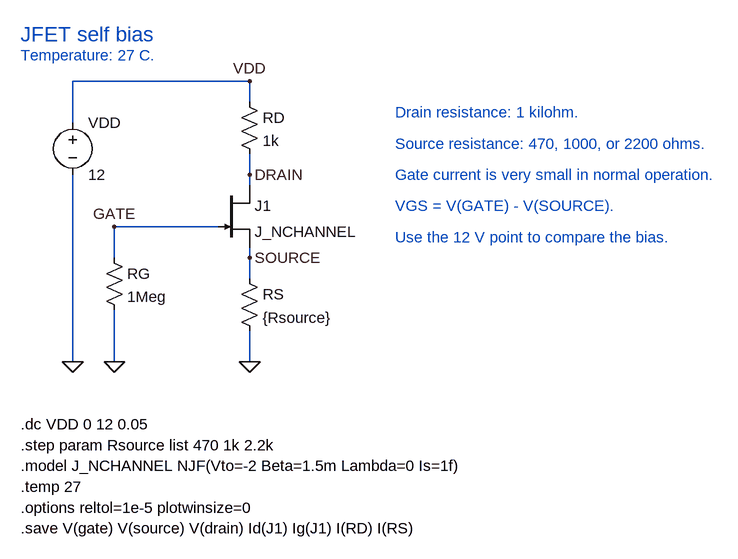
[diagram p0: schematic jfet-self-bias.asc]
jfet-self-bias.asc, the LTspice schematic file:
Version 4
SHEET 1 1280 1000
WIRE 128 160 128 96
WIRE 128 96 400 96
WIRE 400 96 400 128
WIRE 400 208 400 256
WIRE 352 320 192 320
WIRE 192 320 192 368
WIRE 400 352 400 400
WIRE 128 240 128 528
WIRE 192 448 192 528
WIRE 400 480 400 528
FLAG 400 96 VDD
FLAG 400 240 DRAIN
FLAG 192 320 GATE
FLAG 400 368 SOURCE
FLAG 128 528 0
FLAG 192 528 0
FLAG 400 528 0
SYMBOL voltage 128 144 R0
SYMATTR InstName VDD
SYMATTR Value 12
SYMBOL res 384 112 R0
SYMATTR InstName RD
SYMATTR Value 1k
SYMBOL njf 352 256 R0
SYMATTR InstName J1
SYMATTR Value J_NCHANNEL
SYMBOL res 384 384 R0
SYMATTR InstName RS
SYMATTR Value {Rsource}
SYMBOL res 176 352 R0
SYMATTR InstName RG
SYMATTR Value 1Meg
TEXT 48 24 Left 3 ;JFET self bias
TEXT 48 56 Left 2 ;Temperature: 27 C.
TEXT 624 144 Left 2 ;Drain resistance: 1 kilohm.
TEXT 624 192 Left 2 ;Source resistance: 470, 1000, or 2200 ohms.
TEXT 624 240 Left 2 ;Gate current is very small in normal operation.
TEXT 624 288 Left 2 ;VGS = V(GATE) - V(SOURCE).
TEXT 624 336 Left 2 ;Use the 12 V point to compare the bias.
TEXT 48 624 Left 2 !.dc VDD 0 12 0.05
TEXT 48 656 Left 2 !.step param Rsource list 470 1k 2.2k
TEXT 48 688 Left 2 !.model J_NCHANNEL NJF(Vto=-2 Beta=1.5m Lambda=0 Is=1f)
TEXT 48 720 Left 2 !.temp 27
TEXT 48 752 Left 2 !.options reltol=1e-5 plotwinsize=0
TEXT 48 784 Left 2 !.save V(gate) V(source) V(drain) Id(J1) Ig(J1) I(RD) I(RS)

The netlist it stands for:
* jfet-self-bias.asc
VDD VDD 0 12
RD VDD DRAIN 1k
J1 DRAIN GATE SOURCE J_NCHANNEL
RS SOURCE 0 {Rsource}
RG GATE 0 1Meg
.model NJF NJF
.model PJF PJF
.lib standard.jft
* JFET self bias
* Temperature: 27 C.
* Drain resistance: 1 kilohm.
* Source resistance: 470, 1000, or 2200 ohms.
* Gate current is very small in normal operation.
* VGS = V(GATE) - V(SOURCE).
* Use the 12 V point to compare the bias.
.dc VDD 0 12 0.05
.step param Rsource list 470 1k 2.2k
.model J_NCHANNEL NJF(Vto=-2 Beta=1.5m Lambda=0 Is=1f)
.temp 27
.options reltol=1e-5 plotwinsize=0
.save V(gate) V(source) V(drain) Id(J1) Ig(J1) I(RD) I(RS)
.backanno
.end